# EAGLE design ICS-USB Converter (EAGLE 6.5.0)
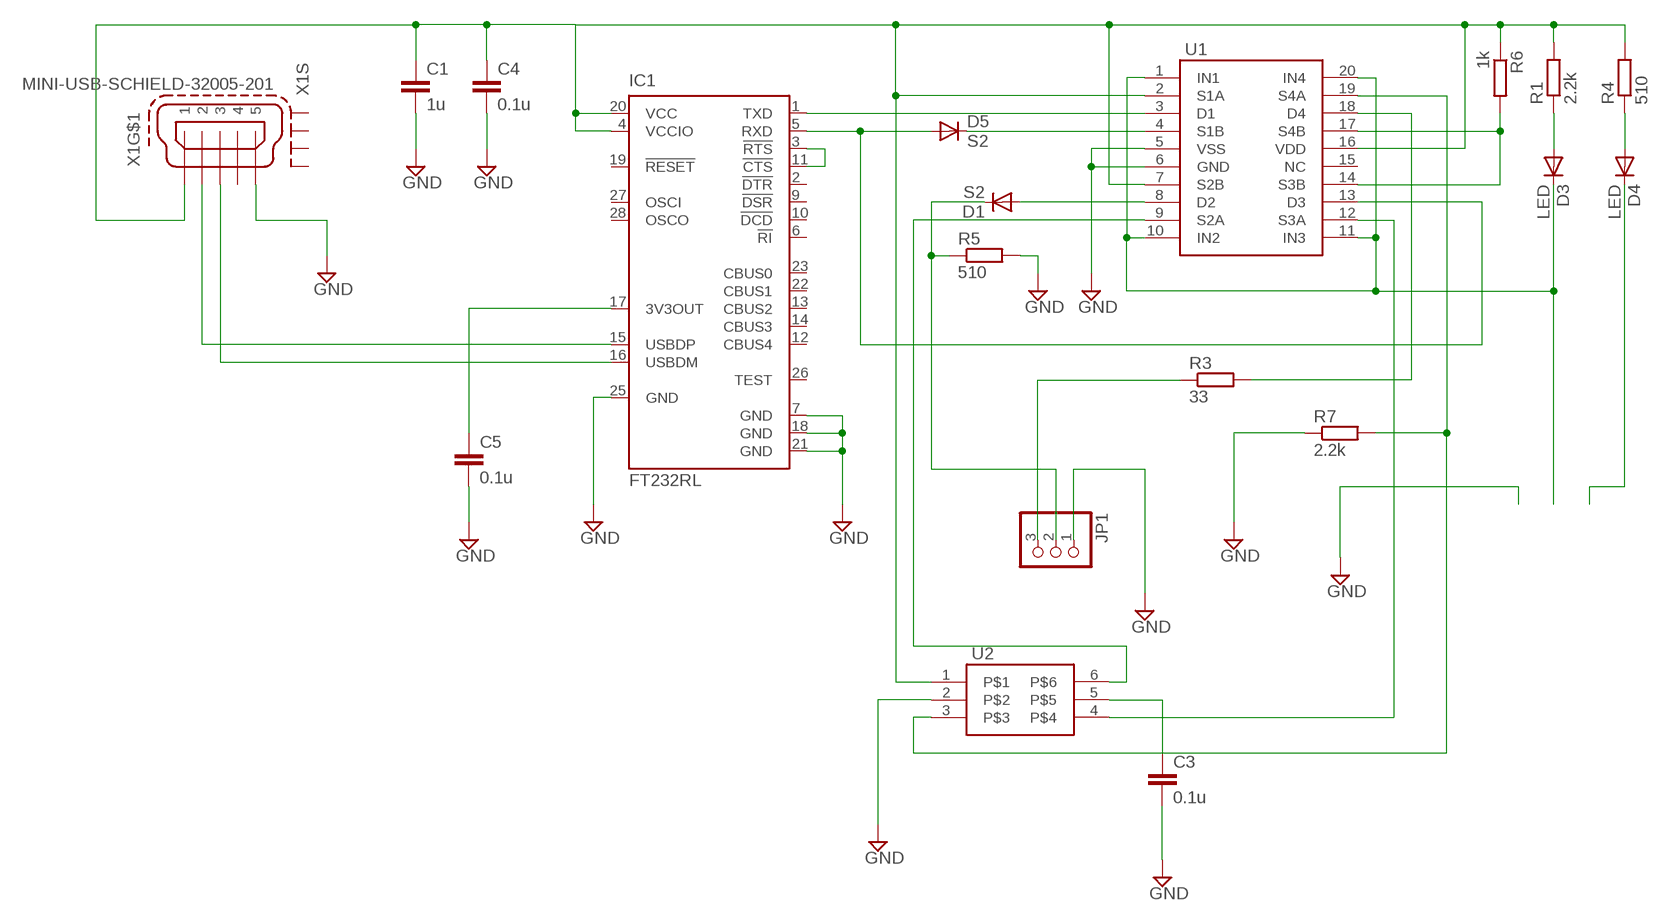
[diagram p0: schematic, sheet 1]

## Parts
C1  1u  C-EUC2012  [C2012]
C3  0.1u  C-EUC1608  [C1608]
C4  0.1u  C-EUC1608  [C1608]
C5  0.1u  C-EUC1608  [C1608]
D1  S2  DIODE-SOD523  [SOD523]
D3  LED  DIODE-SOD523  [SOD523]
D4  LED  DIODE-SOD523  [SOD523]
D5  S2  DIODE-SOD523  [SOD523]
IC1  FT232RL  [SSOP28]
JP1  PINHD-1X3  [1X03]
R1  2.2k  R-EU_R1608  [C1608]
R3  33  R-EU_R1608  [C1608]
R4  510  R-EU_R1608  [C1608]
R5  510  R-EU_R1608  [C1608]
R6  1k  R-EU_R1608  [C1608]
R7  2.2k  R-EU_R1608  [C1608]
U1  ADG734  [TSSOP20]
U2  HA5SOT23-6  [SOT23-6]
X1  MINI-USB-SCHIELD-32005-201  [32005-201]

## Nets
GND: C1.2 C3.2 C4.2 C5.2 IC1.7(GND) IC1.18(GND) IC1.21(GND) IC1.25(GND) JP1.1 R5.2 R7.1 U1.5(VSS) U1.6(GND) U2.2 X1.5
N$1: IC1.3(!RTS) IC1.11(!CTS)
N$2: IC1.1(TXD) U1.3(D1)
N$3: U1.12(S3A) U2.4
N$4: D5.A IC1.5(RXD) U1.13(D3)
N$5: D5.C U1.4(S1B)
N$6: R7.2 U1.19(S4A) U2.3
N$7: D4.C
N$8: C5.1 IC1.17(3V3OUT)
N$9: D1.A U1.8(D2)
N$12: D1.C JP1.2 R5.1
N$13: JP1.3 R3.1
N$14: R6.2 U1.14(S3B) U1.17(S4B)
N$15: D3.A R1.1
N$16: D4.A R4.1
N$17: IC1.15(USBDP) X1.2
N$18: IC1.16(USBDM) X1.3
N$19: R3.2 U1.18(D4)
N$20: D3.C U1.1(IN1) U1.10(IN2) U1.11(IN3) U1.20(IN4)
N$21: C1.1 C4.1 IC1.4(VCCIO) IC1.20(VCC) R1.2 R4.2 R6.1 U1.2(S1A) U1.7(S2B) U1.16(VDD) U2.1 X1.1
N$22: U1.9(S2A) U2.6
N$23: C3.1 U2.5
Unconnected: IC1.2(!DTR) IC1.6(!RI) IC1.9(!DSR) IC1.10(!DCD) IC1.12(CBUS4) IC1.13(CBUS2) IC1.14(CBUS3) IC1.19(!RESET) IC1.22(CBUS1) IC1.23(CBUS0) IC1.26(TEST) IC1.27(OSCI) IC1.28(OSCO) U1.15(NC) X1.4 X1.M1(S:S1) X1.M2(S:S2) X1.M3(S:S3) X1.M4(S:S4)

## Library data of the parts
C1 C3-C5 = rcl:C-EU: CAPACITOR, European symbol
D1 D3-D5 = diode:DIODE-: DIODE
IC1 = ftdichip:FT232R: Source: http://www.ftdichip.com/Documents/DataSheets/DS_FT232R_v104.pdf; MPN: FT232RL; OC_FARNELL: 1146032; OC_NEWARK: 91K9918
JP1 = pinhead:PINHD-1X3: PIN HEADER
R1 R3-R7 = rcl:R-EU_: RESISTOR, European symbol
U1 = original:ADG734
U2 = original:HA5
X1 = con-cypressindustries:MINI-USB-SCHIELD-: MINI USB-B Conector Source: www.cypressindustries.com; OC_FARNELL: unknown; OC_NEWARK: unknown

## Board
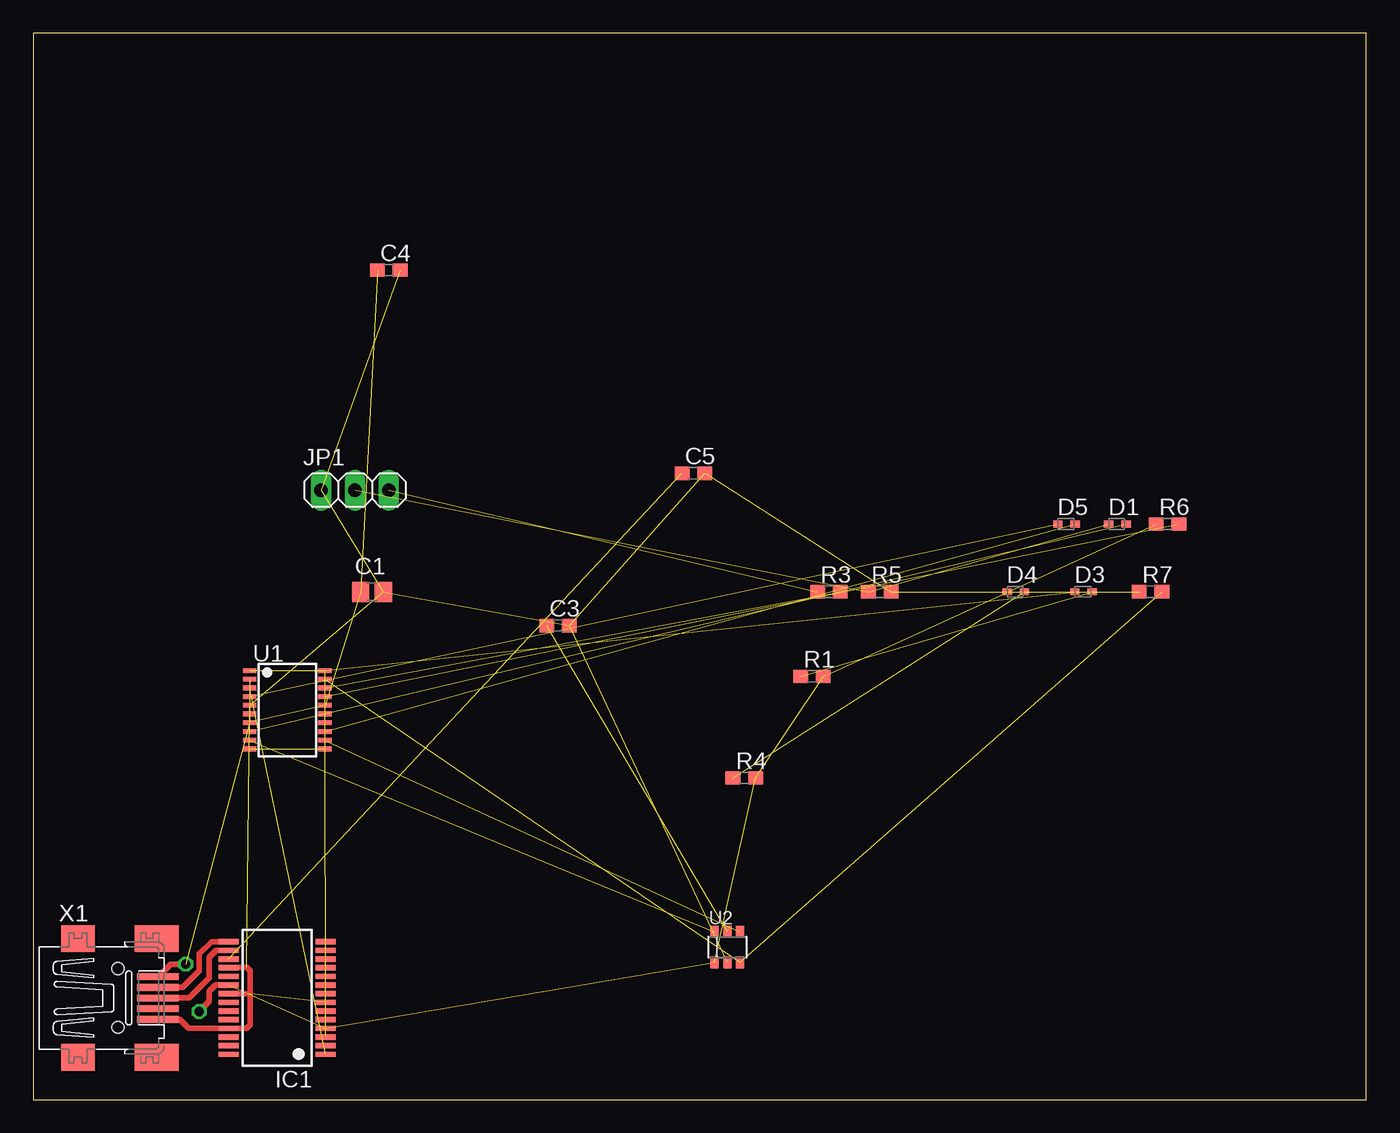
[diagram p1: board, top side]
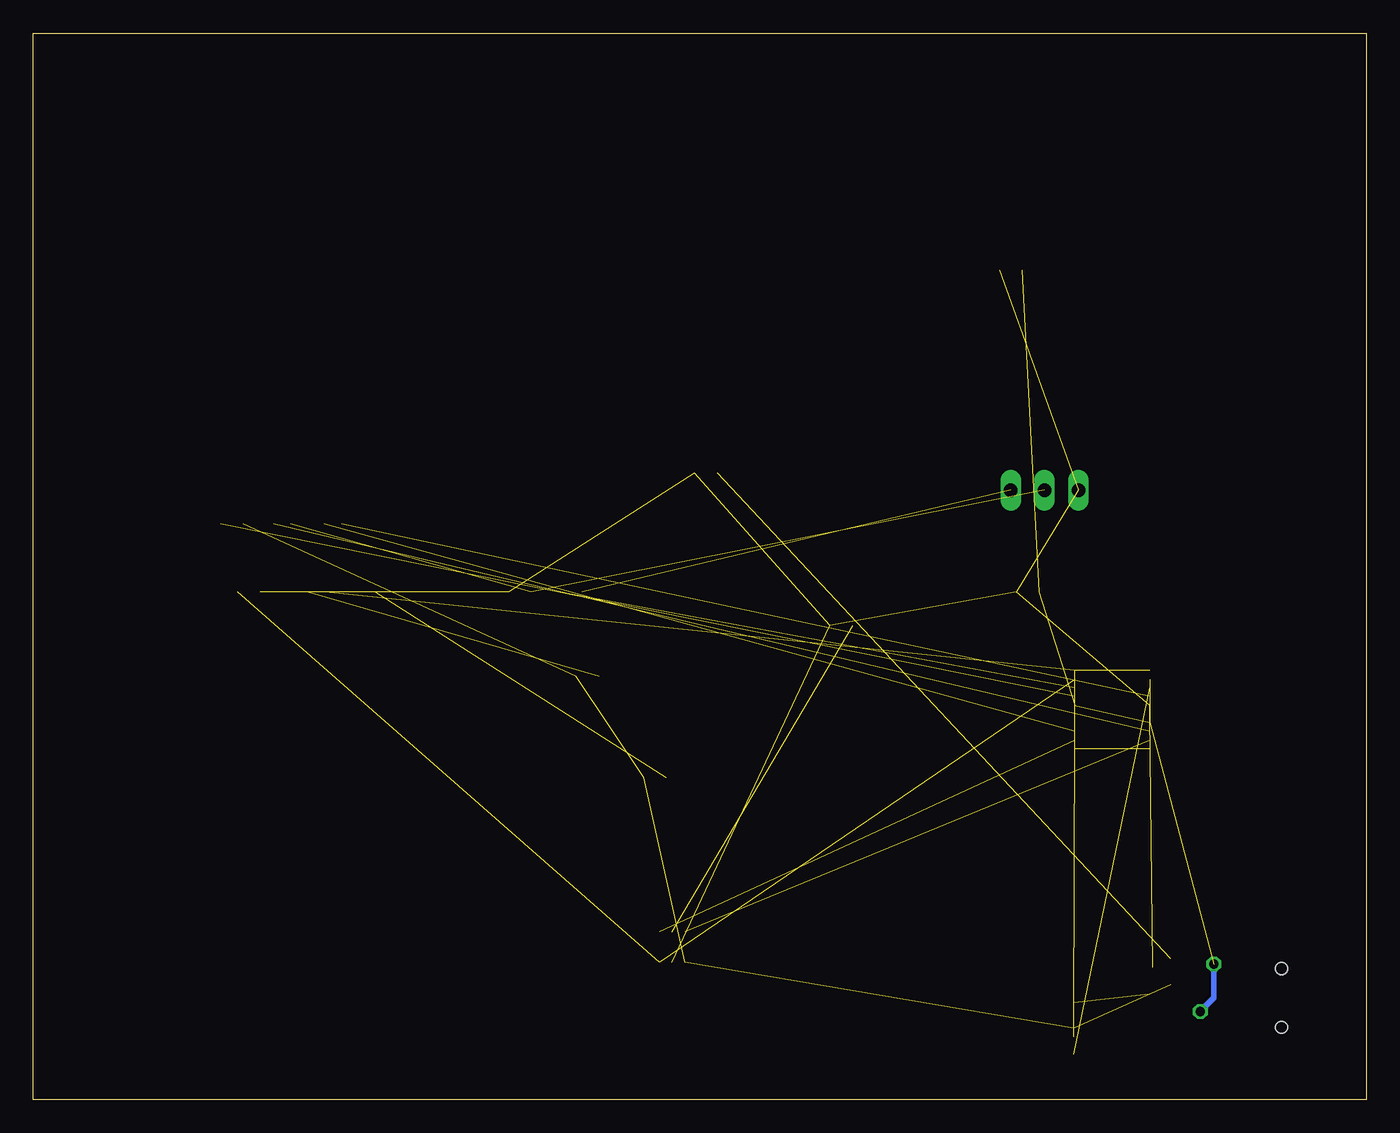
[diagram p2: board, bottom side, seen from below]

Size 100 x 80 mm. Coordinates in mm from the lower left corner, seen from the top.
Outline: 0,0 100,0 100,80 0,80 0,0
Copper layers (1*16): Top 0.035mm / dielectric 1.5mm / Bottom 0.035mm
Design rules "default": minimum track width 10mil, minimum drill 24mil, track to track 8mil, track to pad 8mil, pad to pad 8mil, via to via 8mil, smd to smd 8mil, copper to edge 40mil, drill to drill 8mil, minimum pad ring 10mil, minimum via ring 8mil, stop-mask expansion 4mil, vias tented up to drill 0mil, thermal gap 10mil

### Footprints (pad centres in the part's own frame; a part is rotated, then mirrored left to right if it is on the bottom)
C2012 = smd 1.3 x 1.5: 1 -0.85,0; 2 0.85,0
C1608 = smd 1.1 x 1: 1 -0.85,0; 2 0.85,0
SOD523 = smd 0.7 x 0.5: A 0.7,0; C -0.6,0
SSOP28 = smd 0.4 x 1.5: 1 -4.225,-3.625; 2 -3.575,-3.625; 3 -2.925,-3.625; 4 -2.275,-3.625; 5 -1.625,-3.625; 6 -0.975,-3.625; 7 -0.325,-3.625; 8 0.325,-3.625; 9 0.975,-3.625; 10 1.625,-3.625; 11 2.275,-3.625; 12 2.925,-3.625; 13 3.575,-3.625; 14 4.225,-3.625; 15 4.225,3.625; 16 3.575,3.625; 17 2.925,3.625; 18 2.275,3.625; 19 1.625,3.625; 20 0.975,3.625; 21 0.325,3.625; 22 -0.325,3.625; 23 -0.975,3.625; 24 -1.625,3.625; 25 -2.275,3.625; 26 -2.925,3.625; 27 -3.575,3.625; 28 -4.225,3.625
1X03 = drill 1.016 long: 1 -2.54,0; 2 0,0; 3 2.54,0
TSSOP20 = smd 1 x 0.35: 1 -2.825,2.966; 2 -2.825,2.316; 3 -2.825,1.666; 4 -2.825,1.016; 5 -2.825,0.366; 6 -2.825,-0.284; 7 -2.825,-0.934; 8 -2.825,-1.606; 9 -2.825,-2.256; 10 -2.825,-2.906; 11 2.825,-2.906; 12 2.825,-2.256; 13 2.825,-1.606; 14 2.825,-0.934; 15 2.825,-0.284; 16 2.825,0.366; 17 2.825,1.016; 18 2.825,1.666; 19 2.825,2.316; 20 2.825,2.966
SOT23-6 = smd 0.6 x 0.9: 1 -0.95,-1.15; 2 0,-1.15; 3 0.95,-1.15; 4 0.95,1.15; 5 0,1.15; 6 -0.95,1.15
32005-201 = smd 3.1 x 0.5: 1 3,1.6; 2 3,0.8; 3 3,0; 4 3,-0.8; 5 3,-1.6 | smd 2.5 x 2: M1 -3,-4.45; M2 -3,4.45 | smd 3.3 x 2: M3 2.9,4.45; M4 2.9,-4.45 | hole 0.9: 0,2.2; 0,-2.2

### Placement (x,y rotation side)
C1  25.4,38.1 0 top
C3  39.37,35.56 0 top
C4  26.67,62.23 0 top
C5  49.53,46.99 0 top
D1  81.28,43.18 0 top
D3  78.74,38.1 0 top
D4  73.66,38.1 0 top
D5  77.47,43.18 0 top
IC1  18.29,7.62 90 top
JP1  24.13,45.72 0 top
R1  58.42,31.75 0 top
R3  59.69,38.1 0 top
R4  53.34,24.13 0 top
R5  63.5,38.1 0 top
R6  85.09,43.18 0 top
R7  83.82,38.1 0 top
U1  19.05,29.21 0 top
U2  52.07,11.43 0 top
X1  6.35,7.62 0 top

### Tracks (layer width: path | path; a pad name or v marks a point on that pad's centre or on a via)
GND  (11 unrouted)
  Top 0.406: X1.5 11,6.02 11.67,5.34 IC1.25 16.01,5.34 16.26,5.59 16.26,7.95 | 16.26,7.95 16.26,9.65 16,9.91 14.42,9.91 IC1.18 | IC1.21 16.26,7.95
N$1  (1 unrouted)
N$2  (1 unrouted)
N$3  (1 unrouted)
N$4  (2 unrouted)
N$5  (1 unrouted)
N$6  (2 unrouted)
N$8  (1 unrouted)
N$9  (1 unrouted)
N$12  (2 unrouted)
N$13  (1 unrouted)
N$14  (2 unrouted)
N$15  (1 unrouted)
N$16  (1 unrouted)
N$17
  Top 0.406: X1.2 11.21,8.42 12.45,9.65 12.45,10.92 13.37,11.85 IC1.15
N$18
  Top 0.406: X1.3 11.68,7.62 13.21,9.14 13.21,10.67 13.73,11.2 IC1.16
N$19  (1 unrouted)
N$20  (4 unrouted)
N$21  (via drill 0.7)  (10 unrouted)
  Top 0.406: IC1.20 13.68,8.6 13.21,8.13 13.21,7.37 v12.45,6.6 | X1.1 10.29,10.16 v11.43,10.16
  Bottom 0.406: v11.43,10.16 11.43,7.62 v12.45,6.6
N$22  (1 unrouted)
N$23  (1 unrouted)